# EAGLE design conn_board (EAGLE 9.6.2)
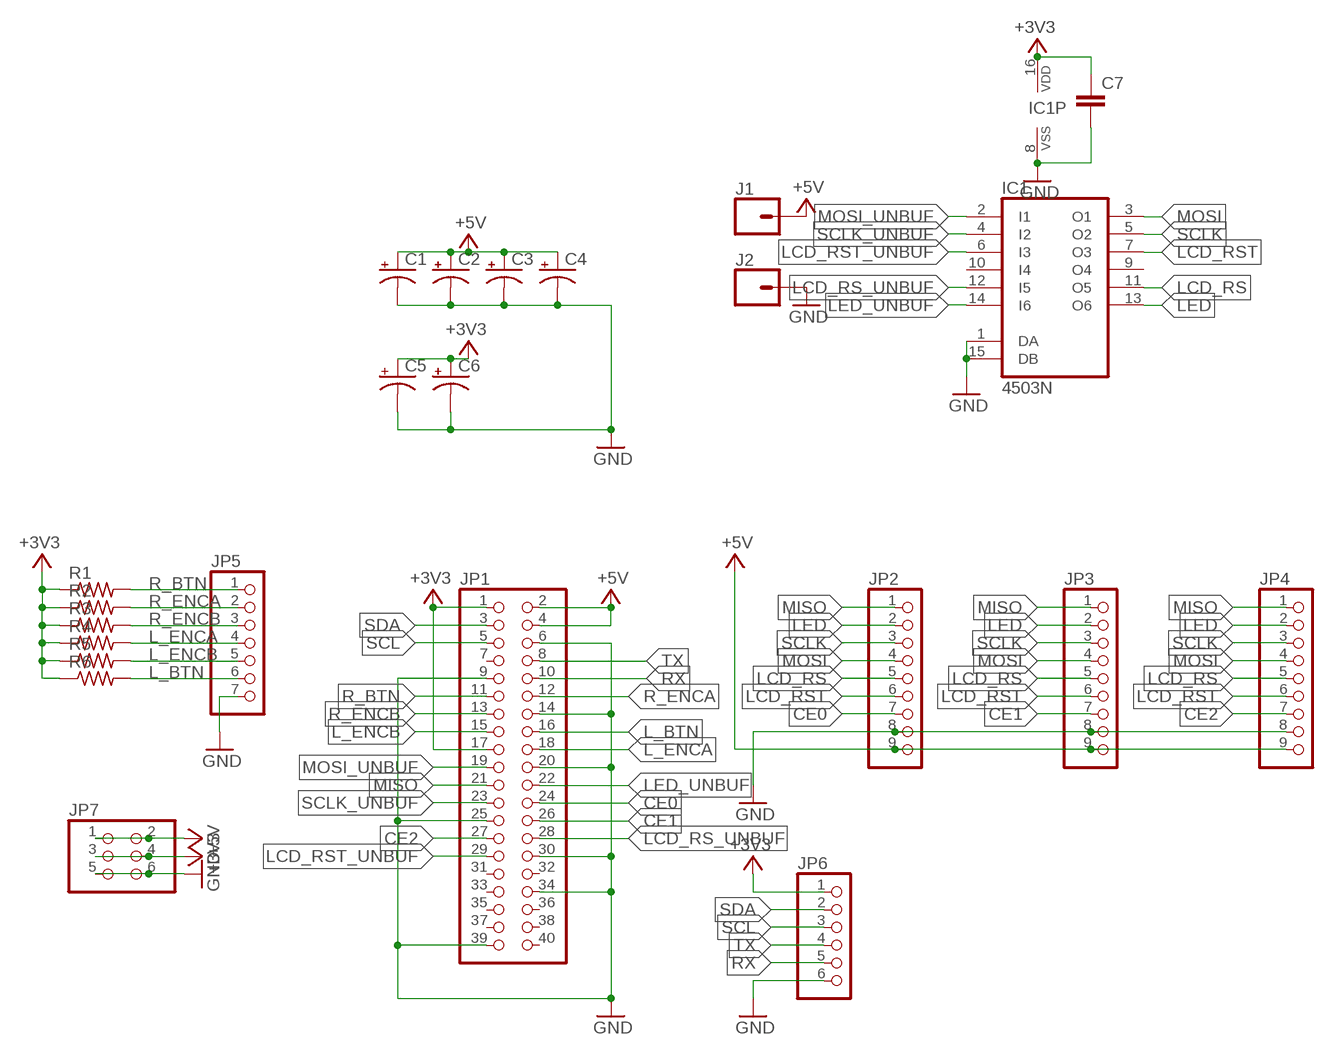
[diagram p0: schematic, sheet 1]

## Parts
C1  CPOL-USSANYO_F13  [SANYO-OSCON_F13]
C2  CPOL-USSANYO_F13  [SANYO-OSCON_F13]
C3  CPOL-USSANYO_F13  [SANYO-OSCON_F13]
C4  CPOL-USSANYO_F13  [SANYO-OSCON_F13]
C5  CPOL-USSANYO_F13  [SANYO-OSCON_F13]
C6  CPOL-USSANYO_F13  [SANYO-OSCON_F13]
C7  C-EU050-055X075  [C050-055X075]
IC1  4503N  [DIL16]
J1  CONN_01PTH_LONGPAD  [1X01_LONGPAD]
J2  CONN_01PTH_LONGPAD  [1X01_LONGPAD]
JP1  PINHD-2X20  [2X20]
JP2  PINHD-1X9  [1X09]
JP3  PINHD-1X9  [1X09]
JP4  PINHD-1X9  [1X09]
JP5  PINHD-1X7  [1X07]
JP6  PINHD-1X6  [1X06]
JP7  PINHD-2X3  [2X03]
R1  R-US_0207/10  [0207/10]
R2  R-US_0207/10  [0207/10]
R3  R-US_0207/10  [0207/10]
R4  R-US_0207/10  [0207/10]
R5  R-US_0207/10  [0207/10]
R6  R-US_0207/10  [0207/10]

## Nets
+3V3: C5.+ C6.+ C7.1 IC1.16(VDD) JP1.1 JP1.17 JP6.1 JP7.3 JP7.4 R1.1 R2.1 R3.1 R4.1 R5.1 R6.1
+5V: C1.+ C2.+ C3.+ C4.+ J1.1 JP1.2 JP1.4 JP2.9 JP3.9 JP4.9 JP7.1 JP7.2
CE0: JP1.24 JP2.7
CE1: JP1.26 JP3.7
CE2: JP1.27 JP4.7
GND: C1.- C2.- C3.- C4.- C5.- C6.- C7.2 IC1.1(DA) IC1.8(VSS) IC1.15(DB) J2.1 JP1.6 JP1.9 JP1.14 JP1.20 JP1.25 JP1.30 JP1.34 JP1.39 JP2.8 JP3.8 JP4.8 JP5.7 JP6.6 JP7.5 JP7.6
L_BTN: JP1.16 JP5.6 R6.2
L_ENCA: JP1.18 JP5.4 R4.2
L_ENCB: JP1.15 JP5.5 R5.2
LCD_RS: IC1.11(O5) JP2.5 JP3.5 JP4.5
LCD_RS_UNBUF: IC1.12(I5) JP1.28
LCD_RST: IC1.7(O3) JP2.6 JP3.6 JP4.6
LCD_RST_UNBUF: IC1.6(I3) JP1.29
LED: IC1.13(O6) JP2.2 JP3.2 JP4.2
LED_UNBUF: IC1.14(I6) JP1.22
MISO: JP1.21 JP2.1 JP3.1 JP4.1
MOSI: IC1.3(O1) JP2.4 JP3.4 JP4.4
MOSI_UNBUF: IC1.2(I1) JP1.19
R_BTN: JP1.11 JP5.1 R1.2
R_ENCA: JP1.12 JP5.2 R2.2
R_ENCB: JP1.13 JP5.3 R3.2
RX: JP1.10 JP6.5
SCL: JP1.5 JP6.3
SCLK: IC1.5(O2) JP2.3 JP3.3 JP4.3
SCLK_UNBUF: IC1.4(I2) JP1.23
SDA: JP1.3 JP6.2
TX: JP1.8 JP6.4
Unconnected: IC1.9(O4) IC1.10(I4) JP1.7 JP1.31 JP1.32 JP1.33 JP1.35 JP1.36 JP1.37 JP1.38 JP1.40

## Library data of the parts
C1-C6 = rcl:CPOL-US: POLARIZED CAPACITOR, American symbol; SPICEPREFIX: C
C7 = rcl:C-EU: CAPACITOR, European symbol; SPICEPREFIX: C
IC1 = 45xx:4503: Tri-state hex BUFFER, 74C367, 80C97
J1 J2 = SparkFun-Connectors:CONN_01: Single connection point. Often used as Generic Header-pin footprint for 0.1 inch spaced/style header connections On any of the 0.1 inch spaced packages, you can populate with these: Break Away Headers - Straight <https://www.sparkfun.com/products/116> (PRT-00116) Break Away Male Headers - Right Angle <https://www.sparkfun.com/products/553> (PRT-00553) Female Headers <https://www.sparkfun.com/products/115> (PRT-00115) Break Away Headers - Machine Pin <https://www.sparkfun.com/products/117> (PRT-00117) Break Away Female Headers - Swiss Machine Pin <https://www.sparkfun.com/products/743> (PRT-00743) This device is also useful as a general connection point to wire up your design to another part of your project. Our various solder wires solder well into these plated through hole pads. Hook-Up Wire - Assortment (Stranded, 22 AWG) <https://www.sparkfun.com/products/11375> (PRT-11375) Hook-Up Wire - Assortment (Solid Core, 22 AWG) <https://www.sparkfun.com/products/11367> (PRT-11367) View the entire wire category on our website here <https://www.sparkfun.com/categories/141> Special notes: SMTSO-256-ET is a "flush mount" nut for a 4-40 screw. We mostly use this on specialty testbeds; it is a nice way to connect hardware to your PCB at an adjustable hieght. Also note, the SNAP packages are for using a snappable style connector. We sell a baggie of snaps and they are also used on two LilyPad designs: Snap Assortment - 30 pack (male and female) <https://www.sparkfun.com/products/11347> (DEV-11347) LilyPad Arduino SimpleSnap <https://www.sparkfun.com/products/10941> (DEV-10941) LilyPad SimpleSnap Protoboard <https://www.sparkfun.com/products/10940> (DEV-10940)
JP1 = pinhead:PINHD-2X20: PIN HEADER
JP2-JP4 = pinhead:PINHD-1X9: PIN HEADER
JP5 = pinhead:PINHD-1X7: PIN HEADER
JP6 = pinhead:PINHD-1X6: PIN HEADER
JP7 = pinhead:PINHD-2X3: PIN HEADER
R1-R6 = rcl:R-US_: RESISTOR, American symbol; SPICEPREFIX: R

## Board
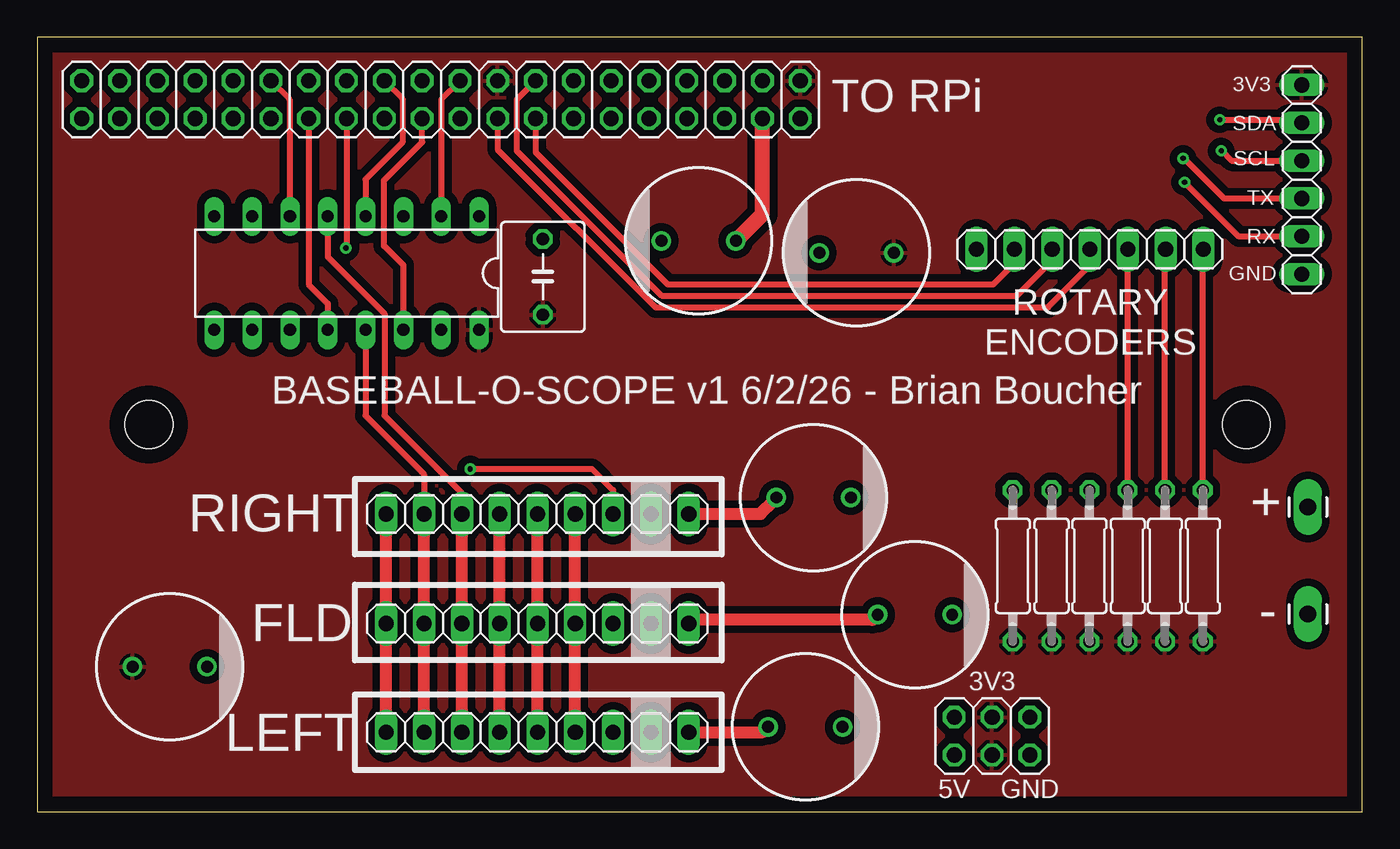
[diagram p1: board, top side]
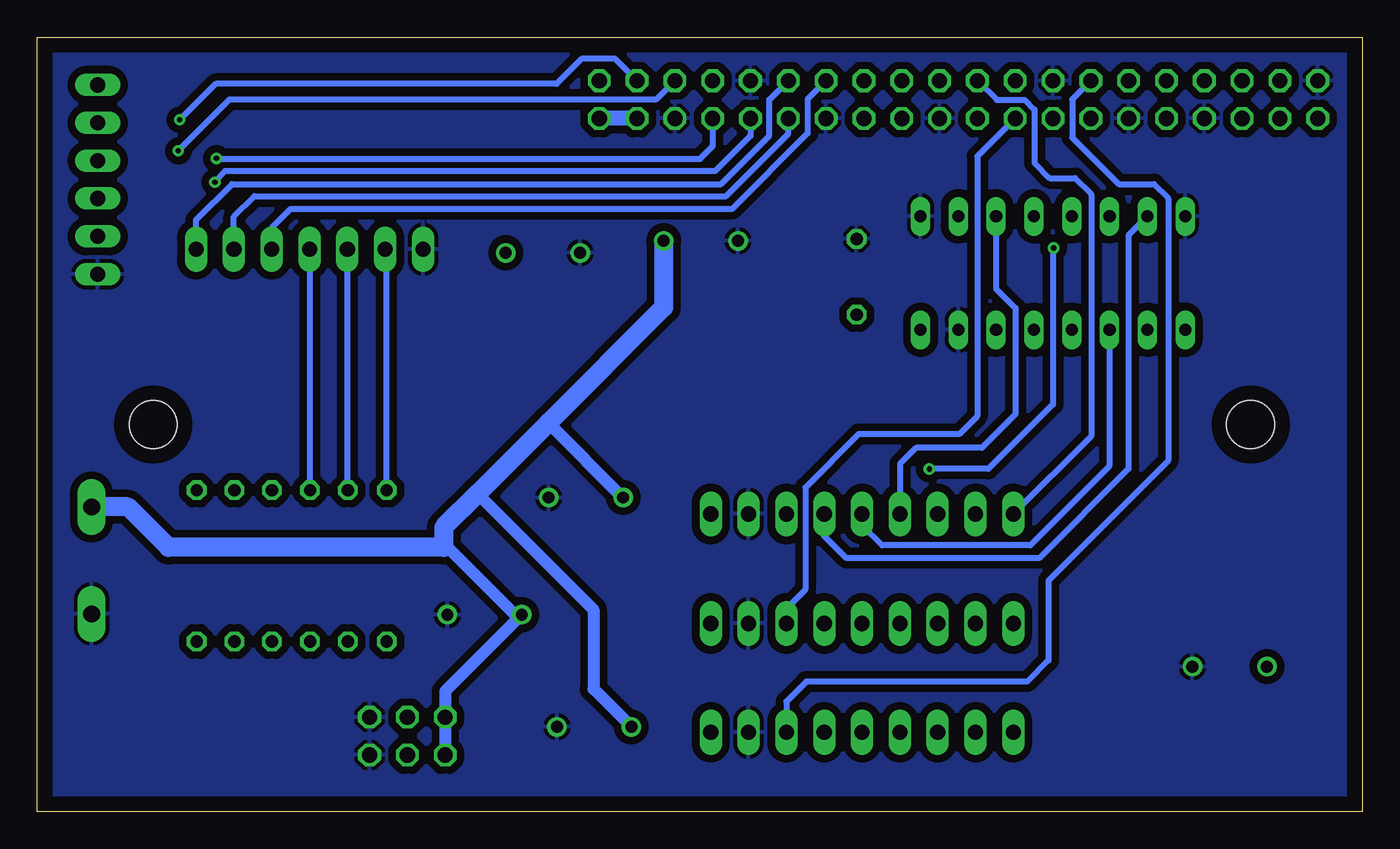
[diagram p2: board, bottom side, seen from below]

Size 89 x 52 mm. Coordinates in mm from the lower left corner, seen from the top.
Outline: 0,0 89,0 89,52 0,52 0,0
Copper layers (1*16): Top 0.035mm / dielectric 1.5mm / Bottom 0.035mm
Design rules "default": minimum track width 6mil, minimum drill 0.35mm, track to track 6mil, track to pad 6mil, pad to pad 6mil, via to via 6mil, smd to smd 6mil, copper to edge 40mil, drill to drill 6mil, minimum pad ring 10mil, minimum via ring 8mil, stop-mask expansion 4mil, vias tented up to drill 0mil, thermal gap 10mil
Holes 3.2 mm at 7.5,26 81.2,26

### Footprints (pad centres in the part's own frame; a part is rotated, then mirrored left to right if it is on the bottom)
SANYO-OSCON_F13 = drill 0.8 pad 1.27: + 2.5,0; - -2.5,0
C050-055X075 = drill 0.813 octagon: 1 -2.54,0; 2 2.54,0
DIL16 = drill 0.813 long: 1 -8.89,-3.81; 2 -6.35,-3.81; 3 -3.81,-3.81; 4 -1.27,-3.81; 5 1.27,-3.81; 6 3.81,-3.81; 7 6.35,-3.81; 8 8.89,-3.81; 9 8.89,3.81; 10 6.35,3.81; 11 3.81,3.81; 12 1.27,3.81; 13 -1.27,3.81; 14 -3.81,3.81; 15 -6.35,3.81; 16 -8.89,3.81
1X01_LONGPAD = drill 1.118 pad 1.88 long: 1 0,0
2X20 = drill 1.016 octagon: 1 -24.13,-1.27; 2 -24.13,1.27; 3 -21.59,-1.27; 4 -21.59,1.27; 5 -19.05,-1.27; 6 -19.05,1.27; 7 -16.51,-1.27; 8 -16.51,1.27; 9 -13.97,-1.27; 10 -13.97,1.27; 11 -11.43,-1.27; 12 -11.43,1.27; 13 -8.89,-1.27; 14 -8.89,1.27; 15 -6.35,-1.27; 16 -6.35,1.27; 17 -3.81,-1.27; 18 -3.81,1.27; 19 -1.27,-1.27; 20 -1.27,1.27; 21 1.27,-1.27; 22 1.27,1.27; 23 3.81,-1.27; 24 3.81,1.27; 25 6.35,-1.27; 26 6.35,1.27; 27 8.89,-1.27; 28 8.89,1.27; 29 11.43,-1.27; 30 11.43,1.27; 31 13.97,-1.27; 32 13.97,1.27; 33 16.51,-1.27; 34 16.51,1.27; 35 19.05,-1.27; 36 19.05,1.27; 37 21.59,-1.27; 38 21.59,1.27; 39 24.13,-1.27; 40 24.13,1.27
1X09 = drill 1.016 long: 1 -10.16,0; 2 -7.62,0; 3 -5.08,0; 4 -2.54,0; 5 0,0; 6 2.54,0; 7 5.08,0; 8 7.62,0; 9 10.16,0
1X07 = drill 1.016 long: 1 -7.62,0; 2 -5.08,0; 3 -2.54,0; 4 0,0; 5 2.54,0; 6 5.08,0; 7 7.62,0
1X06 = drill 1.016 long: 1 -6.35,0; 2 -3.81,0; 3 -1.27,0; 4 1.27,0; 5 3.81,0; 6 6.35,0
2X03 = drill 1.016 octagon: 1 -2.54,-1.27; 2 -2.54,1.27; 3 0,-1.27; 4 0,1.27; 5 2.54,-1.27; 6 2.54,1.27
0207/10 = drill 0.813 octagon: 1 -5.08,0; 2 5.08,0

### Placement (x,y rotation side)
C1  52.15,21.09 180 top
C2  51.59,5.69 180 top
C3  58.95,13.23 180 top
C4  44.42,38.33 0 top
C5  8.91,9.74 180 top
C6  55.03,37.53 0 top
C7  33.96,35.92 90 top
IC1  20.78,36.16 180 top
J1  85.34,20.46 0 top
J2  85.34,13.28 0 top
JP1  27.12,47.81 180 top
JP2  33.6,12.64 0 top
JP3  33.6,19.99 0 top
JP4  33.6,5.34 0 top
JP5  70.71,37.76 180 top
JP6  84.94,42.44 270 top
JP7  64.14,5.08 0 top
R1  78.29,16.51 90 top
R2  75.75,16.51 90 top
R3  73.24,16.51 90 top
R4  70.67,16.51 90 top
R5  68.14,16.51 90 top
R6  65.52,16.51 90 top

### Tracks (layer width: path | path; a pad name or v marks a point on that pad's centre or on a via)
+3V3
  pour Top (isolate 0.508): 0,0 89,0 89,52 0,52
+5V
  Top 0.813: C1.+ 49.44,20.88 49.44,20.84 48.59,19.99 JP3.9 | JP2.9 43.99,12.87 56.1,12.87 C3.+ | JP4.9 48.74,5.34 C2.+
  Top 1.016: C4.+ 48.71,40.12 JP1.4
  Bottom 0.813: 61.77,17.82 61.5,17.82 56.91,13.23 C3.+ 61.59,8.09 JP7.2 JP7.1 | C1.+ 54.67,26.12 | 59.43,21.36 51.64,13.56 51.64,8.24 C2.+
  Bottom 1.016: JP1.4 JP1.2
  Bottom 1.27: C4.+ 46.92,33.86 54.67,26.12 59.43,21.36 61.7,19.09 61.7,17.74 | 61.7,17.74 61.77,17.82 | 61.7,17.74 80.18,17.74 82.89,20.46 J1.1
CE0
  Bottom 0.406: JP1.24 25.86,44 25.86,26.57 27.08,25.35 33.83,25.35 37.41,21.77 37.41,14.91 38.68,13.64 JP2.7
CE1  (via drill 0.35)
  Top 0.406: JP1.26 20.77,37.89 v20.73,37.85 | v29.08,23.01 37.26,23.01 38.68,21.59 JP3.7
  Bottom 0.406: v29.08,23.01 25.12,23.01 20.78,27.36 20.78,37.8 v20.73,37.85
CE2
  Bottom 0.406: JP1.27 19.48,47.83 19.48,45.26 16.36,42.14 13.99,42.14 13.03,41.17 13.03,23.57 21.08,15.52 21.08,10.16 22.5,8.74 37.34,8.74 38.68,7.4 JP4.7
GND
  pour Bottom (isolate 0.508): 0,0 89,0 89,52 0,52
L_BTN
  Top 0.406: JP1.16 33.47,44.28 42.34,35.41 64.21,35.41 65.63,36.83 JP5.6
  Bottom 0.406: R6.2 65.52,37.65 JP5.6
L_ENCA
  Top 0.406: JP1.18 30.93,44.46 41.53,33.86 67.89,33.86 70.71,36.67 JP5.4
  Bottom 0.406: JP5.4 70.71,21.62 R4.2
L_ENCB
  Top 0.406: JP1.15 32.21,47.82 32.21,44.37 41.94,34.65 65.79,34.65 68.17,37.03 JP5.5
  Bottom 0.406: R5.2 68.14,37.73 JP5.5
LCD_RS
  Top 0.813: JP3.5 JP2.5 JP4.5
  Bottom 0.406: IC1.11 16.99,32.33 16.99,23.19 22.3,17.88 32.23,17.88 33.6,19.25 JP3.5
LCD_RS_UNBUF
  Top 0.406: JP1.28 18.23,35.39 19.51,34.1 IC1.12
LCD_RST
  Top 0.813: JP3.6 JP2.6 JP4.6
  Bottom 0.406: IC1.7 15.7,38.71 15.7,23.01 21.69,17.02 34.65,17.02 36.17,18.54 36.17,19.96 JP3.6
LCD_RST_UNBUF
  Top 0.406: JP1.29 16.94,47.83 16.94,40 IC1.6
LED
  Top 0.406: IC1.13 22.05,26.59 25.98,22.66 JP3.2
  Top 0.813: JP4.2 JP2.2 JP3.2
LED_UNBUF
  Top 0.406: IC1.14 24.59,36.7 23.29,38 23.29,42.39 25.85,44.95 JP1.22
MISO
  Top 0.813: JP4.1 JP2.1 JP3.1
  Bottom 0.406: JP1.21 24.56,47.79 22.68,47.79 22.02,47.13 22.02,43.56 21.01,42.55 19.3,42.55 18.21,41.45 18.21,25.22 JP3.1
MOSI
  Top 0.813: JP3.4 JP2.4 JP4.4
  Bottom 0.406: JP3.4 31.04,20.01 31.04,23.37 29.97,24.43 25.55,24.43 23.29,26.7 23.29,33.81 24.59,35.11 IC1.3
MOSI_UNBUF
  Top 0.406: JP1.19 27.13,47.83 IC1.2
R_BTN
  Top 0.406: R1.2 78.29,37.72 JP5.1
  Bottom 0.406: JP5.1 78.33,39.73 75.92,42.14 43.08,42.14 39.83,45.39 39.83,47.81 JP1.11
R_ENCA
  Top 0.406: R2.2 75.75,37.73 JP5.2
  Bottom 0.406: JP5.2 75.79,39.93 74.4,41.33 42.75,41.33 38.55,45.52 JP1.12
R_ENCB
  Top 0.406: R3.2 JP5.3
  Bottom 0.406: JP1.13 37.26,47.83 37.26,45.54 42.34,40.46 72.01,40.46 73.25,39.22 JP5.3
RX  (via drill 0.35)
  Top 0.406: v77.06,42.27 80.72,38.61 84.91,38.61 JP6.5
  Bottom 0.406: JP1.10 41.09,45.38 43.47,43 76.4,43 77.06,42.34 v77.06,42.27
SCL  (via drill 0.35)
  Top 0.406: v79.53,44.37 79.55,44.37 80.21,43.71 JP6.3
  Bottom 0.406: JP1.5 47.45,47.8 76.1,47.8 v79.53,44.37
SCLK
  Top 0.406: IC1.5 19.51,37.25 23.32,33.45 23.32,26.59 28.52,21.39 JP3.3
  Top 0.813: JP3.3 JP2.3 JP4.3
SCLK_UNBUF
  Top 0.406: JP1.23 24.54,47.86 24.54,44.94 22.05,42.46 IC1.4
SDA  (via drill 0.35)
  Top 0.406: v79.43,46.46 84.73,46.46 JP6.2
  Bottom 0.406: JP1.3 50.17,50.55 52.43,50.55 54.1,48.87 77.01,48.87 v79.43,46.46
TX  (via drill 0.35)
  Top 0.406: JP6.4 79.7,41.17 77.01,43.87 v76.96,43.87
  Bottom 0.406: JP1.8 43.63,44.68 44.48,43.84 76.94,43.84 v76.96,43.87

### Text on the board
tPlace: 3V3 | TO RPi | SDA | SCL | TX | RX | GND | ROTARY / ENCODERS | BASEBALL-O-SCOPE v1 6/2/26 - Brian Boucher | + | RIGHT | - | FLD | 3V3 | LEFT | 5V | GND